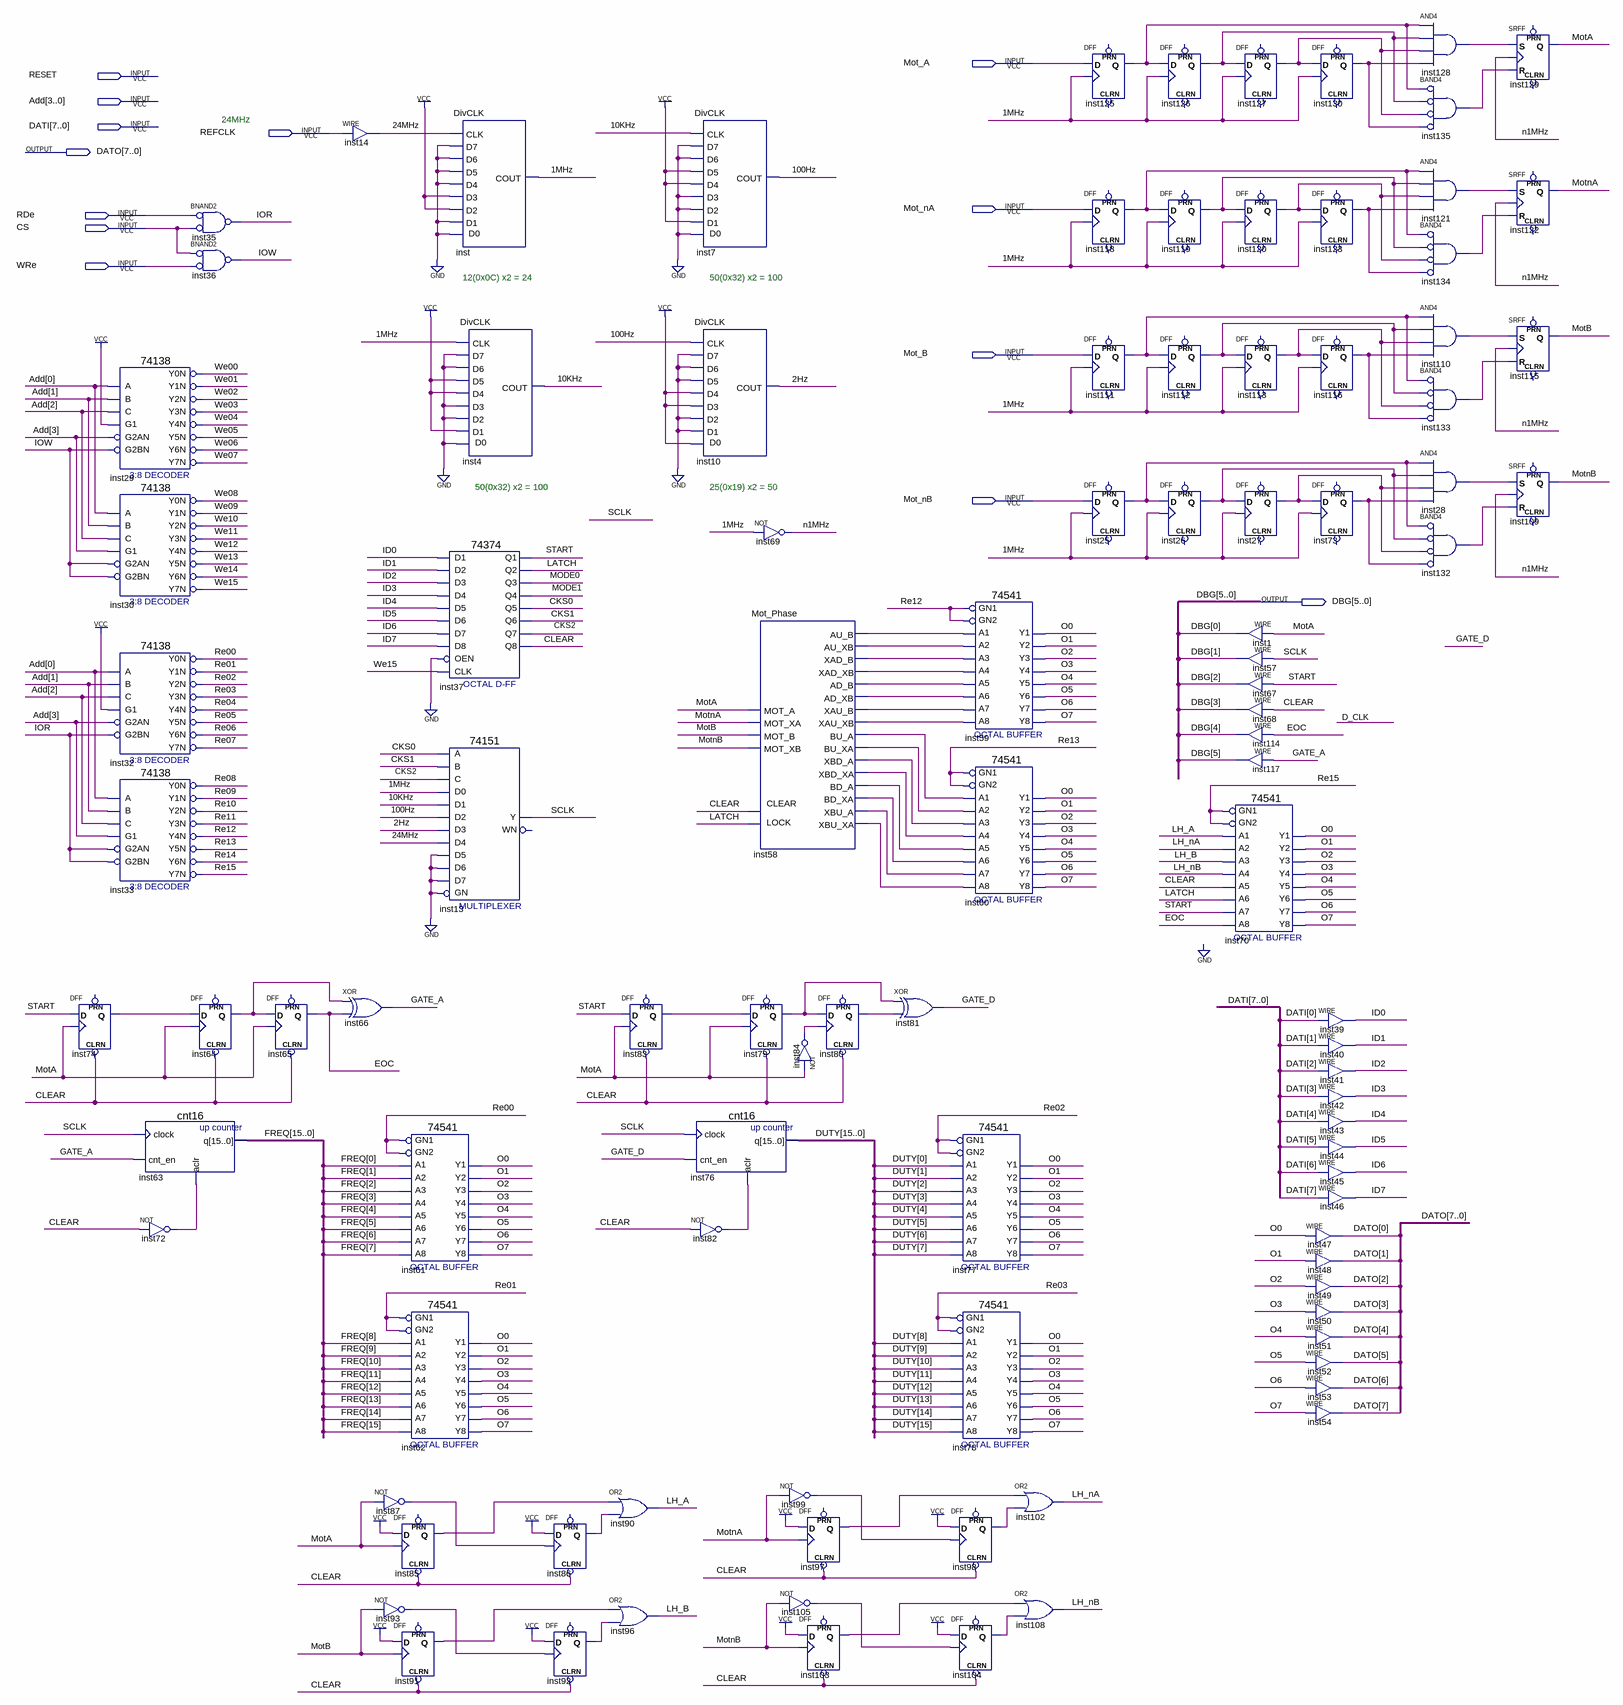
[diagram p0: schematic sheet]
// Quartus schematic Mot_Sch.bdf as structural Verilog: 101 symbols, 13 pins
module Mot_Sch (
  input  Mot_A,
  input  RESET,
  input  [3:0] Add,
  input  [7:0] DATI,
  input  REFCLK,
  input  Mot_nA,
  input  RDe,
  input  CS,
  input  WRe,
  input  Mot_B,
  input  Mot_nB,
  output [7:0] DATO,
  output [5:0] DBG
);

  wire \1MHz , \2Hz , \10KHz , \24MHz , \100Hz , CKS0, CKS1, CKS2, CLEAR, EOC, GATE_A, GATE_D, ID0, ID1, ID2,
       ID3, ID4, ID5, ID6, ID7, inst25_q, inst26_q, inst27_q, inst28_out, inst58_ad_b, inst58_ad_xb,
       inst58_au_b, inst58_au_xb, inst58_bd_a, inst58_bd_xa, inst58_bu_a, inst58_bu_xa, inst58_xad_b,
       inst58_xad_xb, inst58_xau_b, inst58_xau_xb, inst58_xbd_a, inst58_xbd_xa, inst58_xbu_a, inst58_xbu_xa,
       inst64_q, inst72_out, inst73_q, inst74_q, inst79_q, inst80_q, inst82_out, inst83_q, inst84_out,
       inst85_q, inst86_q, inst87_out, inst91_q, inst92_q, inst93_out, inst97_q, inst98_q, inst99_out,
       inst103_q, inst104_q, inst105_out, inst110_out, inst111_q, inst112_q, inst113_q, inst116_q, inst118_q,
       inst119_q, inst120_q, inst121_out, inst123_q, inst125_q, inst126_q, inst127_q, inst128_out, inst130_q,
       inst132_out, inst133_out, inst134_out, inst135_out, IOR, IOW, LATCH, LH_A, LH_B, LH_nA, LH_nB, MODE0,
       MODE1, MotA, MotB, MotnA, MotnB, n1MHz, O0, O1, O2, O3, O4, O5, O6, O7, Re00, Re01, Re02, Re03, Re04,
       Re05, Re06, Re07, Re08, Re09, Re10, Re11, Re12, Re13, Re14, Re15, SCLK, START, We00, We01, We02, We03,
       We04, We05, We06, We07, We08, We09, We10, We11, We12, We13, We14, We15;
  wire [15:0] DUTY, FREQ;

  DFF inst74 (.CLRN(CLEAR), .CLK(MotA), .D(START), .Q(inst74_q));  // open: PRN
  \74138  inst29 (
    .A(Add[0]), .B(Add[1]), .G1(1'b1), .C(Add[2]), .G2AN(Add[3]), .G2BN(IOW), .Y0N(We00), .Y1N(We01),
    .Y2N(We02), .Y3N(We03), .Y4N(We04), .Y5N(We05), .Y6N(We06), .Y7N(We07));
  \74138  inst30 (
    .A(Add[0]), .B(Add[1]), .G1(Add[3]), .C(Add[2]), .G2AN(IOW), .G2BN(IOW), .Y0N(We08), .Y1N(We09),
    .Y2N(We10), .Y3N(We11), .Y4N(We12), .Y5N(We13), .Y6N(We14), .Y7N(We15));
  \74138  inst32 (
    .A(Add[0]), .B(Add[1]), .G1(1'b1), .C(Add[2]), .G2AN(Add[3]), .G2BN(IOR), .Y0N(Re00), .Y1N(Re01),
    .Y2N(Re02), .Y3N(Re03), .Y4N(Re04), .Y5N(Re05), .Y6N(Re06), .Y7N(Re07));
  \74138  inst33 (
    .A(Add[0]), .B(Add[1]), .G1(Add[3]), .C(Add[2]), .G2AN(IOR), .G2BN(IOR), .Y0N(Re08), .Y1N(Re09),
    .Y2N(Re10), .Y3N(Re11), .Y4N(Re12), .Y5N(Re13), .Y6N(Re14), .Y7N(Re15));
  cnt16 inst63 (.clock(SCLK), .cnt_en(GATE_A), .aclr(inst72_out), .q(FREQ));
  not inst72 (inst72_out, CLEAR);
  nand inst35 (IOR, ~RDe, ~CS);  // BNAND2
  nand inst36 (IOW, ~CS, ~WRe);  // BNAND2
  DFF inst64 (.CLRN(CLEAR), .CLK(MotA), .D(inst74_q), .Q(inst64_q));  // open: PRN
  DFF inst65 (.CLRN(CLEAR), .CLK(MotA), .D(inst64_q), .Q(EOC));  // open: PRN
  assign \24MHz  = REFCLK;  // WIRE inst14
  xor inst66 (GATE_A, inst64_q, EOC);
  not inst87 (inst87_out, MotA);
  not inst93 (inst93_out, MotB);
  \74541  inst61 (
    .GN2(Re00), .A1(FREQ[0]), .A4(FREQ[3]), .A3(FREQ[2]), .A2(FREQ[1]), .A7(FREQ[6]), .A6(FREQ[5]),
    .A5(FREQ[4]), .GN1(Re00), .A8(FREQ[7]), .Y8(O7), .Y5(O4), .Y6(O5), .Y7(O6), .Y2(O1), .Y3(O2), .Y4(O3),
    .Y1(O0));
  \74541  inst62 (
    .GN2(Re01), .A1(FREQ[8]), .A4(FREQ[11]), .A3(FREQ[10]), .A2(FREQ[9]), .A7(FREQ[14]), .A6(FREQ[13]),
    .A5(FREQ[12]), .GN1(Re01), .A8(FREQ[15]), .Y8(O7), .Y5(O4), .Y6(O5), .Y7(O6), .Y2(O1), .Y3(O2), .Y4(O3),
    .Y1(O0));
  DFF inst85 (.CLRN(CLEAR), .CLK(MotA), .D(1'b1), .Q(inst85_q));  // open: PRN
  DFF inst91 (.CLRN(CLEAR), .CLK(MotB), .D(1'b1), .Q(inst91_q));  // open: PRN
  DivCLK inst (
    .CLK(\24MHz ), .D0(1'b0), .D1(1'b0), .D2(1'b1), .D3(1'b1), .D4(1'b0), .D5(1'b0), .D6(1'b0), .D7(1'b0),
    .COUT(\1MHz ));
  DivCLK inst4 (
    .CLK(\1MHz ), .D0(1'b0), .D1(1'b1), .D2(1'b0), .D3(1'b0), .D4(1'b1), .D5(1'b1), .D6(1'b0), .D7(1'b0),
    .COUT(\10KHz ));
  \74374  inst37 (
    .D1(ID0), .D2(ID1), .D3(ID2), .D4(ID3), .D6(ID5), .D5(ID4), .OEN(1'b0), .D8(ID7), .D7(ID6), .CLK(We15),
    .Q2(LATCH), .Q3(MODE0), .Q5(CKS0), .Q4(MODE1), .Q6(CKS1), .Q7(CKS2), .Q8(CLEAR), .Q1(START));
  \74151  inst13 (
    .GN(1'b0), .C(CKS2), .B(CKS1), .A(CKS0), .D5(1'b0), .D0(\1MHz ), .D1(\10KHz ), .D4(\24MHz ), .D3(\2Hz ),
    .D2(\100Hz ), .D6(1'b0), .D7(1'b0), .Y(SCLK));  // open: WN
  DFF inst86 (.CLRN(CLEAR), .CLK(inst87_out), .D(1'b1), .Q(inst86_q));  // open: PRN
  DFF inst92 (.CLRN(CLEAR), .CLK(inst93_out), .D(1'b1), .Q(inst92_q));  // open: PRN
  DFF inst83 (.CLRN(CLEAR), .CLK(MotA), .D(START), .Q(inst83_q));  // open: PRN
  or inst90 (LH_A, inst85_q, inst86_q);
  or inst96 (LH_B, inst91_q, inst92_q);
  cnt16 inst76 (.clock(SCLK), .cnt_en(GATE_D), .aclr(inst82_out), .q(DUTY));
  DivCLK inst7 (
    .CLK(\10KHz ), .D0(1'b0), .D1(1'b1), .D2(1'b0), .D3(1'b0), .D4(1'b1), .D5(1'b1), .D6(1'b0), .D7(1'b0),
    .COUT(\100Hz ));
  DivCLK inst10 (
    .CLK(\100Hz ), .D0(1'b1), .D1(1'b0), .D2(1'b0), .D3(1'b1), .D4(1'b1), .D5(1'b0), .D6(1'b0), .D7(1'b0),
    .COUT(\2Hz ));
  not inst82 (inst82_out, CLEAR);
  not inst69 (n1MHz, \1MHz );
  Mot_Phase inst58 (
    .MOT_A(MotA), .MOT_XA(MotnA), .MOT_B(MotB), .MOT_XB(MotnB), .LOCK(LATCH), .CLEAR(CLEAR),
    .AU_B(inst58_au_b), .AU_XB(inst58_au_xb), .XAD_B(inst58_xad_b), .XAD_XB(inst58_xad_xb),
    .AD_B(inst58_ad_b), .AD_XB(inst58_ad_xb), .XAU_B(inst58_xau_b), .XAU_XB(inst58_xau_xb),
    .BU_A(inst58_bu_a), .BU_XA(inst58_bu_xa), .XBD_A(inst58_xbd_a), .XBD_XA(inst58_xbd_xa),
    .BD_A(inst58_bd_a), .BD_XA(inst58_bd_xa), .XBU_A(inst58_xbu_a), .XBU_XA(inst58_xbu_xa));
  DFF inst79 (.CLRN(CLEAR), .CLK(MotA), .D(inst83_q), .Q(inst79_q));  // open: PRN
  not inst99 (inst99_out, MotnA);
  not inst105 (inst105_out, MotnB);
  DFF inst80 (.CLRN(CLEAR), .CLK(inst84_out), .D(inst79_q), .Q(inst80_q));  // open: PRN
  not inst84 (inst84_out, MotA);
  DFF inst97 (.CLRN(CLEAR), .CLK(MotnA), .D(1'b1), .Q(inst97_q));  // open: PRN
  DFF inst103 (.CLRN(CLEAR), .CLK(MotnB), .D(1'b1), .Q(inst103_q));  // open: PRN
  xor inst81 (GATE_D, inst79_q, inst80_q);
  \74541  inst59 (
    .GN2(Re12), .A1(inst58_au_b), .A4(inst58_xad_xb), .A3(inst58_xad_b), .A2(inst58_au_xb),
    .A7(inst58_xau_b), .A6(inst58_ad_xb), .A5(inst58_ad_b), .GN1(Re12), .A8(inst58_xau_xb), .Y8(O7), .Y5(O4),
    .Y6(O5), .Y7(O6), .Y2(O1), .Y3(O2), .Y4(O3), .Y1(O0));
  \74541  inst60 (
    .GN2(Re13), .A1(inst58_bu_a), .A4(inst58_xbd_xa), .A3(inst58_xbd_a), .A2(inst58_bu_xa),
    .A7(inst58_xbu_a), .A6(inst58_bd_xa), .A5(inst58_bd_a), .GN1(Re13), .A8(inst58_xbu_xa), .Y8(O7), .Y5(O4),
    .Y6(O5), .Y7(O6), .Y2(O1), .Y3(O2), .Y4(O3), .Y1(O0));
  \74541  inst77 (
    .GN2(Re02), .A1(DUTY[0]), .A4(DUTY[3]), .A3(DUTY[2]), .A2(DUTY[1]), .A7(DUTY[6]), .A6(DUTY[5]),
    .A5(DUTY[4]), .GN1(Re02), .A8(DUTY[7]), .Y8(O7), .Y5(O4), .Y6(O5), .Y7(O6), .Y2(O1), .Y3(O2), .Y4(O3),
    .Y1(O0));
  \74541  inst78 (
    .GN2(Re03), .A1(DUTY[8]), .A4(DUTY[11]), .A3(DUTY[10]), .A2(DUTY[9]), .A7(DUTY[14]), .A6(DUTY[13]),
    .A5(DUTY[12]), .GN1(Re03), .A8(DUTY[15]), .Y8(O7), .Y5(O4), .Y6(O5), .Y7(O6), .Y2(O1), .Y3(O2), .Y4(O3),
    .Y1(O0));
  DFF inst98 (.CLRN(CLEAR), .CLK(inst99_out), .D(1'b1), .Q(inst98_q));  // open: PRN
  DFF inst104 (.CLRN(CLEAR), .CLK(inst105_out), .D(1'b1), .Q(inst104_q));  // open: PRN
  or inst102 (LH_nA, inst97_q, inst98_q);
  or inst108 (LH_nB, inst103_q, inst104_q);
  DFF inst125 (.CLK(\1MHz ), .D(Mot_A), .Q(inst125_q));  // open: CLRN, PRN
  DFF inst118 (.CLK(\1MHz ), .D(Mot_nA), .Q(inst118_q));  // open: CLRN, PRN
  DFF inst111 (.CLK(\1MHz ), .D(Mot_B), .Q(inst111_q));  // open: CLRN, PRN
  DFF inst25 (.CLK(\1MHz ), .D(Mot_nB), .Q(inst25_q));  // open: CLRN, PRN
  DFF inst126 (.CLK(\1MHz ), .D(inst125_q), .Q(inst126_q));  // open: CLRN, PRN
  DFF inst119 (.CLK(\1MHz ), .D(inst118_q), .Q(inst119_q));  // open: CLRN, PRN
  DFF inst112 (.CLK(\1MHz ), .D(inst111_q), .Q(inst112_q));  // open: CLRN, PRN
  DFF inst26 (.CLK(\1MHz ), .D(inst25_q), .Q(inst26_q));  // open: CLRN, PRN
  DFF inst127 (.CLK(\1MHz ), .D(inst126_q), .Q(inst127_q));  // open: CLRN, PRN
  DFF inst120 (.CLK(\1MHz ), .D(inst119_q), .Q(inst120_q));  // open: CLRN, PRN
  DFF inst113 (.CLK(\1MHz ), .D(inst112_q), .Q(inst113_q));  // open: CLRN, PRN
  DFF inst27 (.CLK(\1MHz ), .D(inst26_q), .Q(inst27_q));  // open: CLRN, PRN
  assign DBG[0] = MotA;  // WIRE inst1
  assign DBG[1] = SCLK;  // WIRE inst57
  assign DBG[2] = START;  // WIRE inst67
  assign DBG[3] = CLEAR;  // WIRE inst68
  assign DBG[4] = EOC;  // WIRE inst114
  assign DBG[5] = GATE_A;  // WIRE inst117
  \74541  inst70 (
    .GN2(Re15), .A1(LH_A), .A4(LH_nB), .A3(LH_B), .A2(LH_nA), .A7(START), .A6(LATCH), .A5(CLEAR), .GN1(Re15),
    .A8(EOC), .Y8(O7), .Y5(O4), .Y6(O5), .Y7(O6), .Y2(O1), .Y3(O2), .Y4(O3), .Y1(O0));
  DFF inst130 (.CLK(\1MHz ), .D(inst127_q), .Q(inst130_q));  // open: CLRN, PRN
  DFF inst123 (.CLK(\1MHz ), .D(inst120_q), .Q(inst123_q));  // open: CLRN, PRN
  DFF inst116 (.CLK(\1MHz ), .D(inst113_q), .Q(inst116_q));  // open: CLRN, PRN
  DFF inst73 (.CLK(\1MHz ), .D(inst27_q), .Q(inst73_q));  // open: CLRN, PRN
  assign ID0 = DATI[0];  // WIRE inst39
  assign ID1 = DATI[1];  // WIRE inst40
  assign ID2 = DATI[2];  // WIRE inst41
  assign ID3 = DATI[3];  // WIRE inst42
  assign ID4 = DATI[4];  // WIRE inst43
  assign ID5 = DATI[5];  // WIRE inst44
  assign ID6 = DATI[6];  // WIRE inst45
  assign ID7 = DATI[7];  // WIRE inst46
  assign DATO[0] = O0;  // WIRE inst47
  assign DATO[1] = O1;  // WIRE inst48
  assign DATO[2] = O2;  // WIRE inst49
  assign DATO[3] = O3;  // WIRE inst50
  assign DATO[4] = O4;  // WIRE inst51
  assign DATO[5] = O5;  // WIRE inst52
  assign DATO[6] = O6;  // WIRE inst53
  assign DATO[7] = O7;  // WIRE inst54
  and inst128 (inst128_out, inst125_q, inst126_q, inst127_q, inst130_q);
  and inst135 (inst135_out, ~inst125_q, ~inst126_q, ~inst127_q, ~inst130_q);  // BAND4
  and inst121 (inst121_out, inst118_q, inst119_q, inst120_q, inst123_q);
  and inst134 (inst134_out, ~inst118_q, ~inst119_q, ~inst120_q, ~inst123_q);  // BAND4
  and inst110 (inst110_out, inst111_q, inst112_q, inst113_q, inst116_q);
  and inst133 (inst133_out, ~inst111_q, ~inst112_q, ~inst113_q, ~inst116_q);  // BAND4
  and inst28 (inst28_out, inst25_q, inst26_q, inst27_q, inst73_q);
  and inst132 (inst132_out, ~inst25_q, ~inst26_q, ~inst27_q, ~inst73_q);  // BAND4
  SRFF inst129 (.S(inst128_out), .R(inst135_out), .CLK(n1MHz), .Q(MotA));  // open: PRN, CLRN
  SRFF inst122 (.S(inst121_out), .R(inst134_out), .CLK(n1MHz), .Q(MotnA));  // open: PRN, CLRN
  SRFF inst115 (.S(inst110_out), .R(inst133_out), .CLK(n1MHz), .Q(MotB));  // open: PRN, CLRN
  SRFF inst109 (.S(inst28_out), .R(inst132_out), .CLK(n1MHz), .Q(MotnB));  // open: PRN, CLRN

  // Notes on the sheet:
  //   24MHz
  //   12(0x0C) x2 = 24
  //   50(0x32) x2 = 100
  //   50(0x32) x2 = 100
  //   25(0x19) x2 = 50
endmodule
